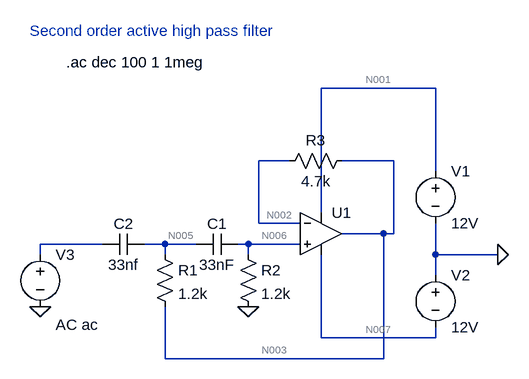
[diagram p0: schematic Draft2.asc]
Draft2.asc, the LTspice schematic file:
Version 4
SHEET 1 880 680
WIRE 480 -80 304 -80
WIRE 256 32 208 32
WIRE 416 32 336 32
WIRE 480 48 480 -80
WIRE 304 112 304 -80
WIRE 208 128 208 32
WIRE 272 128 208 128
WIRE 400 144 336 144
WIRE 416 144 416 32
WIRE 416 144 400 144
WIRE -32 160 -128 160
WIRE 64 160 32 160
WIRE 112 160 64 160
WIRE 192 160 176 160
WIRE 272 160 192 160
WIRE -128 176 -128 160
WIRE 64 176 64 160
WIRE 192 176 192 160
WIRE 480 176 480 128
WIRE 576 176 480 176
WIRE 480 208 480 176
WIRE 304 304 304 176
WIRE 480 304 480 288
WIRE 480 304 304 304
WIRE 64 336 64 256
WIRE 400 336 400 144
WIRE 400 336 64 336
FLAG -128 256 0
FLAG 192 256 0
FLAG 576 176 0
SYMBOL OpAmps\\UniversalOpAmp 304 144 R0
SYMATTR InstName U1
SYMBOL res 48 160 R0
SYMATTR InstName R1
SYMATTR Value 1.2k
SYMBOL res 176 160 R0
SYMATTR InstName R2
SYMATTR Value 1.2k
SYMBOL cap 176 144 R90
WINDOW 0 0 32 VBottom 2
WINDOW 3 32 32 VTop 2
SYMATTR InstName C1
SYMATTR Value 33nF
SYMBOL cap 32 144 R90
WINDOW 0 0 32 VBottom 2
WINDOW 3 32 32 VTop 2
SYMATTR InstName C2
SYMATTR Value 33nf
SYMBOL voltage 480 32 R0
SYMATTR InstName V1
SYMATTR Value 12V
SYMBOL voltage -128 160 R0
WINDOW 123 24 124 Left 2
WINDOW 39 0 0 Left 0
SYMATTR InstName V3
SYMATTR Value ""
SYMATTR Value2 AC ac
SYMBOL voltage 480 192 R0
SYMATTR InstName V2
SYMATTR Value 12V
SYMBOL res 352 16 R90
WINDOW 0 0 56 VBottom 2
WINDOW 3 32 56 VTop 2
SYMATTR InstName R3
SYMATTR Value 4.7k
TEXT -88 -120 Left 2 !.ac dec 100 1 1meg
TEXT -144 -168 Left 2 ;Second order active high pass filter

The netlist it stands for:
* Draft2.asc
XU1 N006 N002 N001 N007 N003 level1 Avol=1Meg GBW=10Meg Vos=0 En=0 Enk=0 In=0 Ink=0 Rin=500Meg  ; pins In+ In- V+ V- OUT
R1 N005 N003 1.2k
R2 N006 0 1.2k
C1 N006 N005 33nF
C2 N005 N004 33nf
V1 N001 0 12V
V3 N004 0 AC ac
V2 0 N007 12V
R3 N003 N002 4.7k
.ac dec 100 1 1meg
* Second order active high pass filter
.lib UniversalOpAmp1.lib
.backanno
.end

* Results of the author's LTspice run, read from the files saved beside the schematic
* Operating Point, zero values left out:
*   V(n001) = 12 V
*   V(n007) = -12 V
*   I(V1) = -24 nA
*   I(V2) = -24 nA
*   Ix(u1:3) = 24 nA
*   Ix(u1:4) = -24 nA
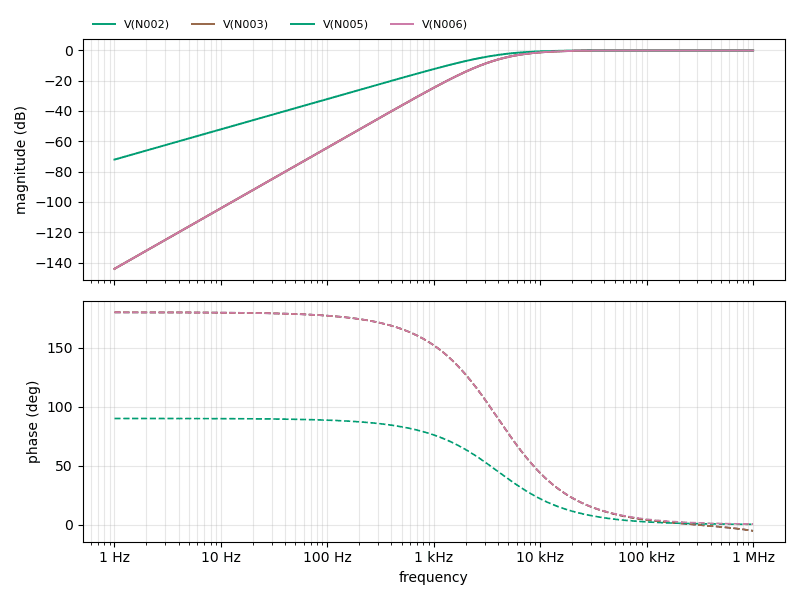
[diagram p1: AC Analysis of Draft2.asc, plotted from the saved traces]
* AC Analysis, 1 run:
*   V(N002): -144.17 dB at 1 Hz, -0.05 dB at 1 MHz, peak -0.01 dB at 239.9 kHz, 3 dB below the peak at 6.236 kHz
*   V(N003): -144.16 dB at 1 Hz, -0.05 dB at 1 MHz, peak -0.01 dB at 239.9 kHz, 3 dB below the peak at 6.236 kHz
*   V(N005): -72.08 dB at 1 Hz, -0.00 dB at 1 MHz, peak -0.00 dB at 1 MHz, 3 dB below the peak at 4.016 kHz
*   V(N006): -144.17 dB at 1 Hz, -0.00 dB at 1 MHz, peak -0.00 dB at 1 MHz, 3 dB below the peak at 6.242 kHz